# Altium schematic sheet STM32.SchDoc
size A4; SheetNumber: 1; SheetTotal: 6
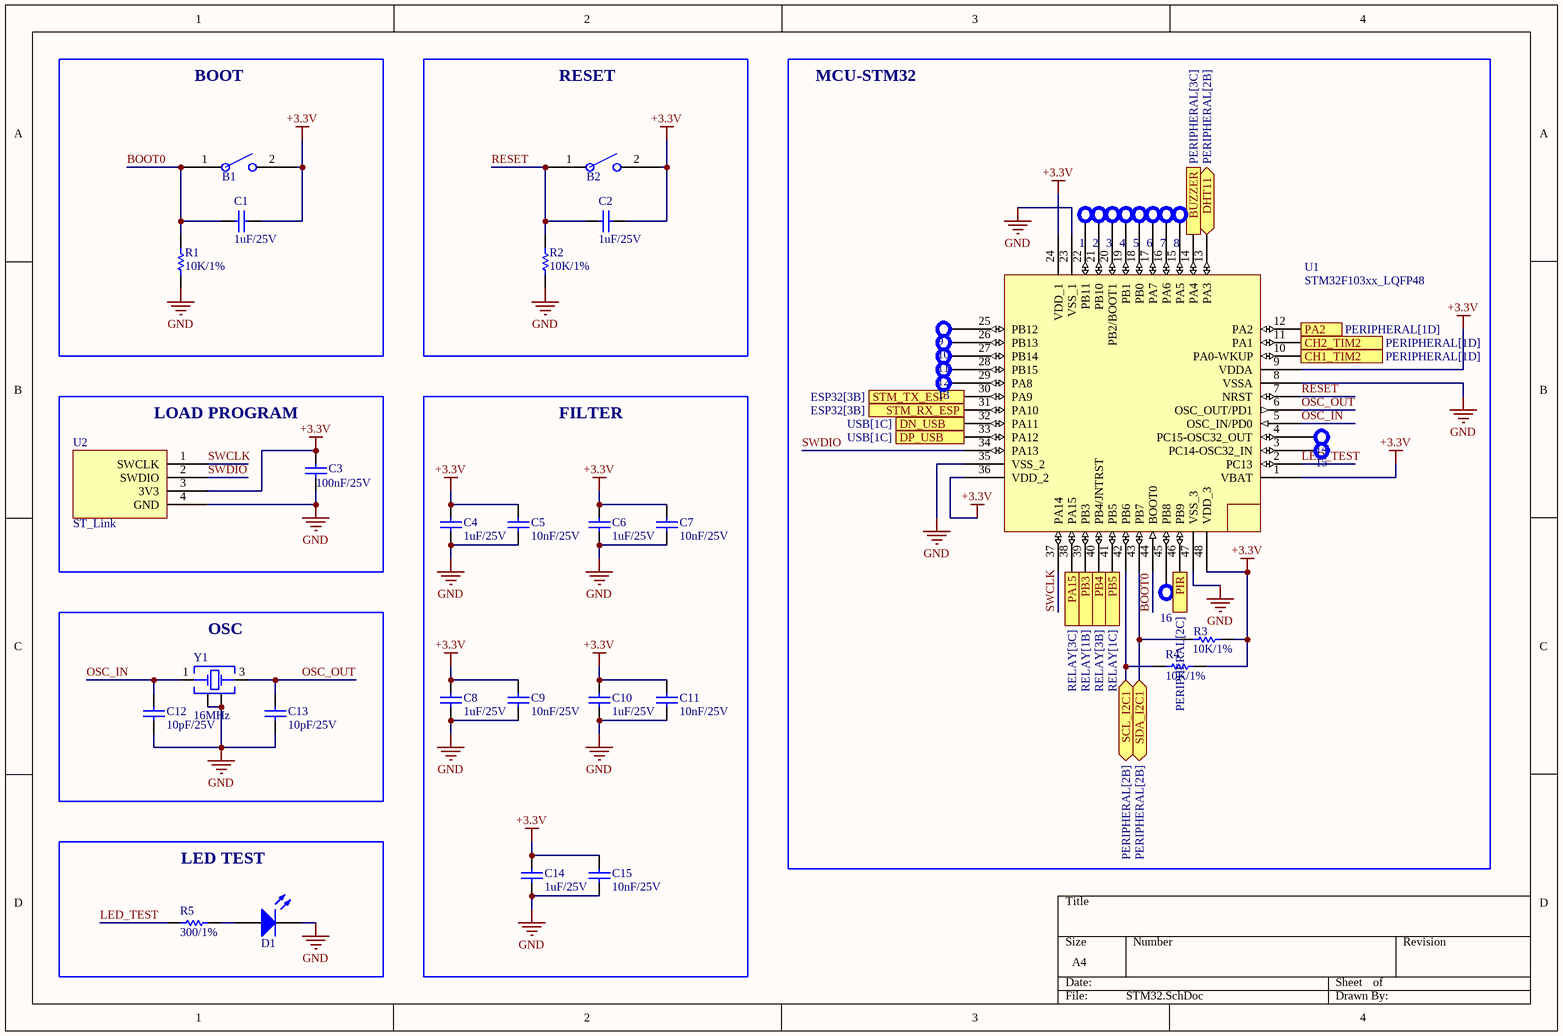
[diagram p0: STM32.SchDoc]

## Parts
1  Test Point  [TP]  (value not drawn)  (no BOM)
2  Test Point  [TP]  (value not drawn)  (no BOM)
3  Test Point  [TP]  (value not drawn)  (no BOM)
4  Test Point  [TP]  (value not drawn)  (no BOM)
5  Test Point  [TP]  (value not drawn)  (no BOM)
6  Test Point  [TP]  (value not drawn)  (no BOM)
7  Test Point  [TP]  (value not drawn)  (no BOM)
8  Test Point  [TP]  (value not drawn)  (no BOM)
9  Test Point  [TP]  (value not drawn)  (no BOM)
10  Test Point  [TP]  (value not drawn)  (no BOM)
11  Test Point  [TP]  (value not drawn)  (no BOM)
12  Test Point  [TP]  (value not drawn)  (no BOM)
13  Test Point  [TP]  (value not drawn)  (no BOM)
14  Test Point  [TP]  (value not drawn)  (no BOM)
15  Test Point  [TP]  (value not drawn)  (no BOM)
16  Test Point  [TP]  (value not drawn)  (no BOM)
B1  Button SMD 2 Pin 3x4mm  [BUTTON SMD 2 PIN]  (value not drawn)
B2  Button SMD 2 Pin 3x4mm  [BUTTON SMD 2 PIN]  (value not drawn)
C1  value 1uF/25V  [CAP-SM-0805]  (hidden comment: Cap Non-Pol SMD)
C2  value 1uF/25V  [CAP-SM-0805]  (hidden comment: Cap Non-Pol SMD)
C3  value 100nF/25V  [CAP-SM-0805]  (hidden comment: Cap Non-Pol SMD)
C4  value 1uF/25V  [CAP-SM-0805]  (hidden comment: Cap Non-Pol SMD)
C5  value 10nF/25V  [CAP-SM-0805]  (hidden comment: Cap Non-Pol SMD)
C6  value 1uF/25V  [CAP-SM-0805]  (hidden comment: Cap Non-Pol SMD)
C7  value 10nF/25V  [CAP-SM-0805]  (hidden comment: Cap Non-Pol SMD)
C8  value 1uF/25V  [CAP-SM-0805]  (hidden comment: Cap Non-Pol SMD)
C9  value 10nF/25V  [CAP-SM-0805]  (hidden comment: Cap Non-Pol SMD)
C10  value 1uF/25V  [CAP-SM-0805]  (hidden comment: Cap Non-Pol SMD)
C11  value 10nF/25V  [CAP-SM-0805]  (hidden comment: Cap Non-Pol SMD)
C12  value 10pF/25V  [CAP-SM-0805]  (hidden comment: Cap Non-Pol SMD)
C13  value 10pF/25V  [CAP-SM-0805]  (hidden comment: Cap Non-Pol SMD)
C14  value 1uF/25V  [CAP-SM-0805]  (hidden comment: Cap Non-Pol SMD)
C15  value 10nF/25V  [CAP-SM-0805]  (hidden comment: Cap Non-Pol SMD)
D1  LED SMD  [LED_0805_Blue]  (value not drawn)
R1  value 10K/1%  [RES-SM-0805]  (hidden comment: RESISTOR SMD)
R2  value 10K/1%  [RES-SM-0805]  (hidden comment: RESISTOR SMD)
R3  value 10K/1%  [RES-SM-0805]  (hidden comment: RESISTOR SMD)
R4  value 10K/1%  [RES-SM-0805]  (hidden comment: RESISTOR SMD)
R5  value 300/1%  [RES-SM-0805]  (hidden comment: RESISTOR SMD)
U1  STM32F103xx_LQFP48  [STM32_LQPF48]
U2  ST_Link  [Header 4 Pin]
Y1  16MHz  [WE-XTAL_CFPX-180]

## Blocks framed on the sheet
BOOT: B1 C1 R1
RESET: B2 C2 R2
LOAD PROGRAM: C3 U2
FILTER: C4-C11 C14 C15
OSC: C12 C13 Y1
LED TEST: D1 R5

## Ports
BUZZER (out, see PERIPHERAL[3C]), CH1_TIM2 (in, see PERIPHERAL[1D]), CH2_TIM2 (in, see PERIPHERAL[1D]), DHT11 (bidir, see PERIPHERAL[2B]), DN_USB (in, see USB[1C]), DP_USB (in, see USB[1C]), PA2 (in, see PERIPHERAL[1D]), PA15 (out, see RELAY[3C]), PB3 (out, see RELAY[1B]), PB4 (out, see RELAY[3B]), PB5 (out, see RELAY[1C]), PIR (in, see PERIPHERAL[2C]), SCL_I2C1 (bidir, see PERIPHERAL[2B]), SDA_I2C1 (bidir, see PERIPHERAL[2B]), STM_RX_ESP (in, see ESP32[3B]), STM_TX_ESP (out, see ESP32[3B])

## Nets
+3.3V: B1.2 B2.2 C1.2 C2.2 C3.2 C4.2 C5.2 C6.2 C7.2 C8.2 C9.2 C10.2 C11.2 C14.2 C15.2 R3.1 R4.1 U1.1(VBAT) U1.9(VDDA) U1.24(VDD_1) U1.36(VDD_2) U1.48(VDD_3) U2.3(3V3)
GND: C3.1 C4.1 C5.1 C6.1 C7.1 C8.1 C9.1 C10.1 C11.1 C12.2 C13.2 C14.1 C15.1 D1.2(K) R1.1 R2.1 U1.8(VSSA) U1.23(VSS_1) U1.35(VSS_2) U1.47(VSS_3) U2.4(GND) Y1.2(GND) Y1.4(GND)
BOOT0: B1.1 C1.1 R1.2 U1.44(BOOT0)
BUZZER: U1.14(PA4) ; port BUZZER
CH1_TIM2: U1.10(PA0-WKUP) ; port CH1_TIM2
CH2_TIM2: U1.11(PA1) ; port CH2_TIM2
DHT11: U1.13(PA3) ; port DHT11
DN_USB: U1.32(PA11) ; port DN_USB
DP_USB: U1.33(PA12) ; port DP_USB
LED_TEST: R5.1 U1.2(PC13)
OSC_IN: C12.1 U1.5(OSC_IN/PD0) Y1.1(Crystal)
OSC_OUT: C13.1 U1.6(OSC_OUT/PD1) Y1.3(Crystal)
PA2: U1.12(PA2) ; port PA2
PA15: U1.38(PA15) ; port PA15
PB3: U1.39(PB3) ; port PB3
PB4: U1.40(PB4/JNTRST) ; port PB4
PB5: U1.41(PB5) ; port PB5
PIR: U1.46(PB9) ; port PIR
RESET: B2.1 C2.1 R2.2 U1.7(NRST)
SCL_I2C1: R4.2 U1.42(PB6) ; port SCL_I2C1
SDA_I2C1: R3.2 U1.43(PB7) ; port SDA_I2C1
STM_RX_ESP: U1.31(PA10) ; port STM_RX_ESP
STM_TX_ESP: U1.30(PA9) ; port STM_TX_ESP
SWCLK: U1.37(PA14) U2.1(SWCLK)
SWDIO: U1.34(PA13) U2.2(SWDIO)
Net1_1: 1.1 U1.22(PB11)
Net2_1: 2.1 U1.21(PB10)
Net3_1: 3.1 U1.20(PB2/BOOT1)
Net4_1: 4.1 U1.19(PB1)
Net5_1: 5.1 U1.18(PB0)
Net6_1: 6.1 U1.17(PA7)
Net7_1: 7.1 U1.16(PA6)
Net8_1: 8.1 U1.15(PA5)
Net9_1: 9.1 U1.25(PB12)
Net10_1: 10.1 U1.26(PB13)
Net11_1: 11.1 U1.27(PB14)
Net12_1: 12.1 U1.28(PB15)
Net13_1: 13.1 U1.29(PA8)
Net14_1: 14.1 U1.4(PC15-OSC32_OUT)
Net15_1: 15.1 U1.3(PC14-OSC32_IN)
Net16_1: 16.1 U1.45(PB8)
NetD1_1: D1.1(A) R5.2

## Notes on the sheet
- MCU-STM32

## Library data of the parts
B1 B2 = BUTTON
C1-C15 = Cap Non-Pol SMD: Capacitor
D1 = LED SMD: LED
R1-R5 = RESISTOR SMD: Resistor
Y1 = 073525166008: WE-XTAL Quartz Crystal, SMT, CFPX-180, 16MHz, +/-20ppm; Manufacturer Part Number: NX3225SA-16.000M-STD-CRS-2; Manufacturer: NDK; Frequency Stability: +/-50ppm; Load Capacitance: 8pF; Frequency Tolerance: +/-15ppm; ComponentLink2Description: Supplier 1 URL; ComponentLink2URL: https://www.mouser.com/ProductDetail/NDK/NX3225SA-16.000M-STD-CRS-2?qs=55YtniHzbhB2yRxaVPeqhg%3D%3D; Operating Temperature: -10 to +60degC; Size: CFPX-104/5032; Frequency: 16MHz; Mounting Technology: SMT; Supplier 3 Name: thegioiic; Supplier 3 SN: N/A; Supplier 3 URL: https://www.thegioiic.com/thach-anh-16mhz-5032-4-chan-smd; ComponentLink1Description: Datasheet link; ComponentLink1URL: https://www.mouser.com/datasheet/2/905/c_NX3225SA_e-1317523.pdf; ComponentLink3Description: Supplier 2 URL; ComponentLink3URL: https://www.digikey.com/en/products/detail/ndk-america-inc/NX3225SA-16-000M-STD-CRS-2/1788469; ComponentLink4Description: Supplier 3 URL; ComponentLink4URL: https://www.thegioiic.com/thach-anh-16mhz-5032-4-chan-smd; Supplier 1 Name: Mouser; Supplier 1 SN: 344-NX3225SA16MCRS2; Supplier 1 URL: https://www.mouser.com/ProductDetail/NDK/NX3225SA-16.000M-STD-CRS-2?qs=55YtniHzbhB2yRxaVPeqhg%3D%3D; Supplier 2 Name: Digi-Key; Supplier 2 SN: 644-1129-2-ND; Supplier 2 URL: https://www.digikey.com/en/products/detail/ndk-america-inc/NX3225SA-16-000M-STD-CRS-2/1788469; Value: 16MHz
1-16 = Test Point: Value: Test Point
U1 = STM32F103xx_LQFP48: Published: 30-May-2008; DatasheetVersion: rev6, Mar-2008; PackageVersion: Mar-2008; PackageReference: LQFP48; Publisher: Altium Limited; PackageDescription: 48-Pin Low-Profile Quad Flat Pack, 7 x 7 mm Body, 0.5 mm Pitch (LQFP48); ComponentLink1Description: Manufacturer Link; ComponentLink1URL: www.st.com/stm32; ComponentLink2Description: Datasheet; ComponentLink2URL: http://www.st.com/stonline/products/literature/ds/13587.pdf